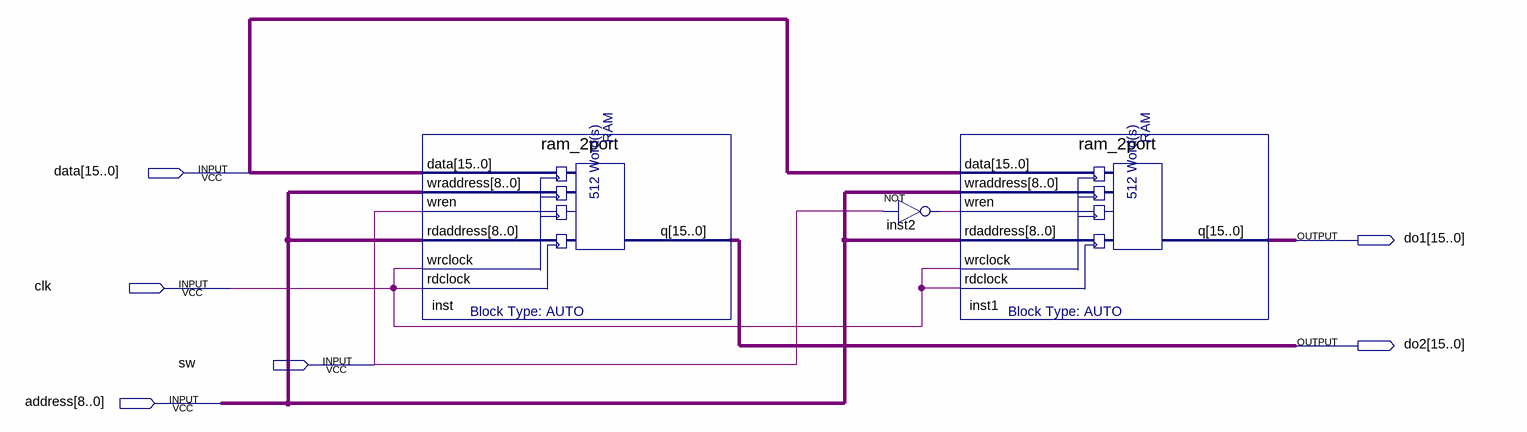
[diagram p0: schematic sheet]
// Quartus schematic Block1.bdf as structural Verilog: 3 symbols, 6 pins
module Block1 (
  input  [15:0] data,
  input  clk,
  input  sw,
  input  [8:0] address,
  output [15:0] do1,
  output [15:0] do2
);

  wire inst2_out;

  ram_2port inst (
    .data(data), .wraddress(address), .wren(sw), .rdaddress(address), .wrclock(clk), .rdclock(clk), .q(do2));
  not inst2 (inst2_out, sw);
  ram_2port inst1 (
    .data(data), .wraddress(address), .wren(inst2_out), .rdaddress(address), .wrclock(clk), .rdclock(clk),
    .q(do1));
endmodule
